# EAGLE schematic ranback_all (EAGLE 9.6.2)
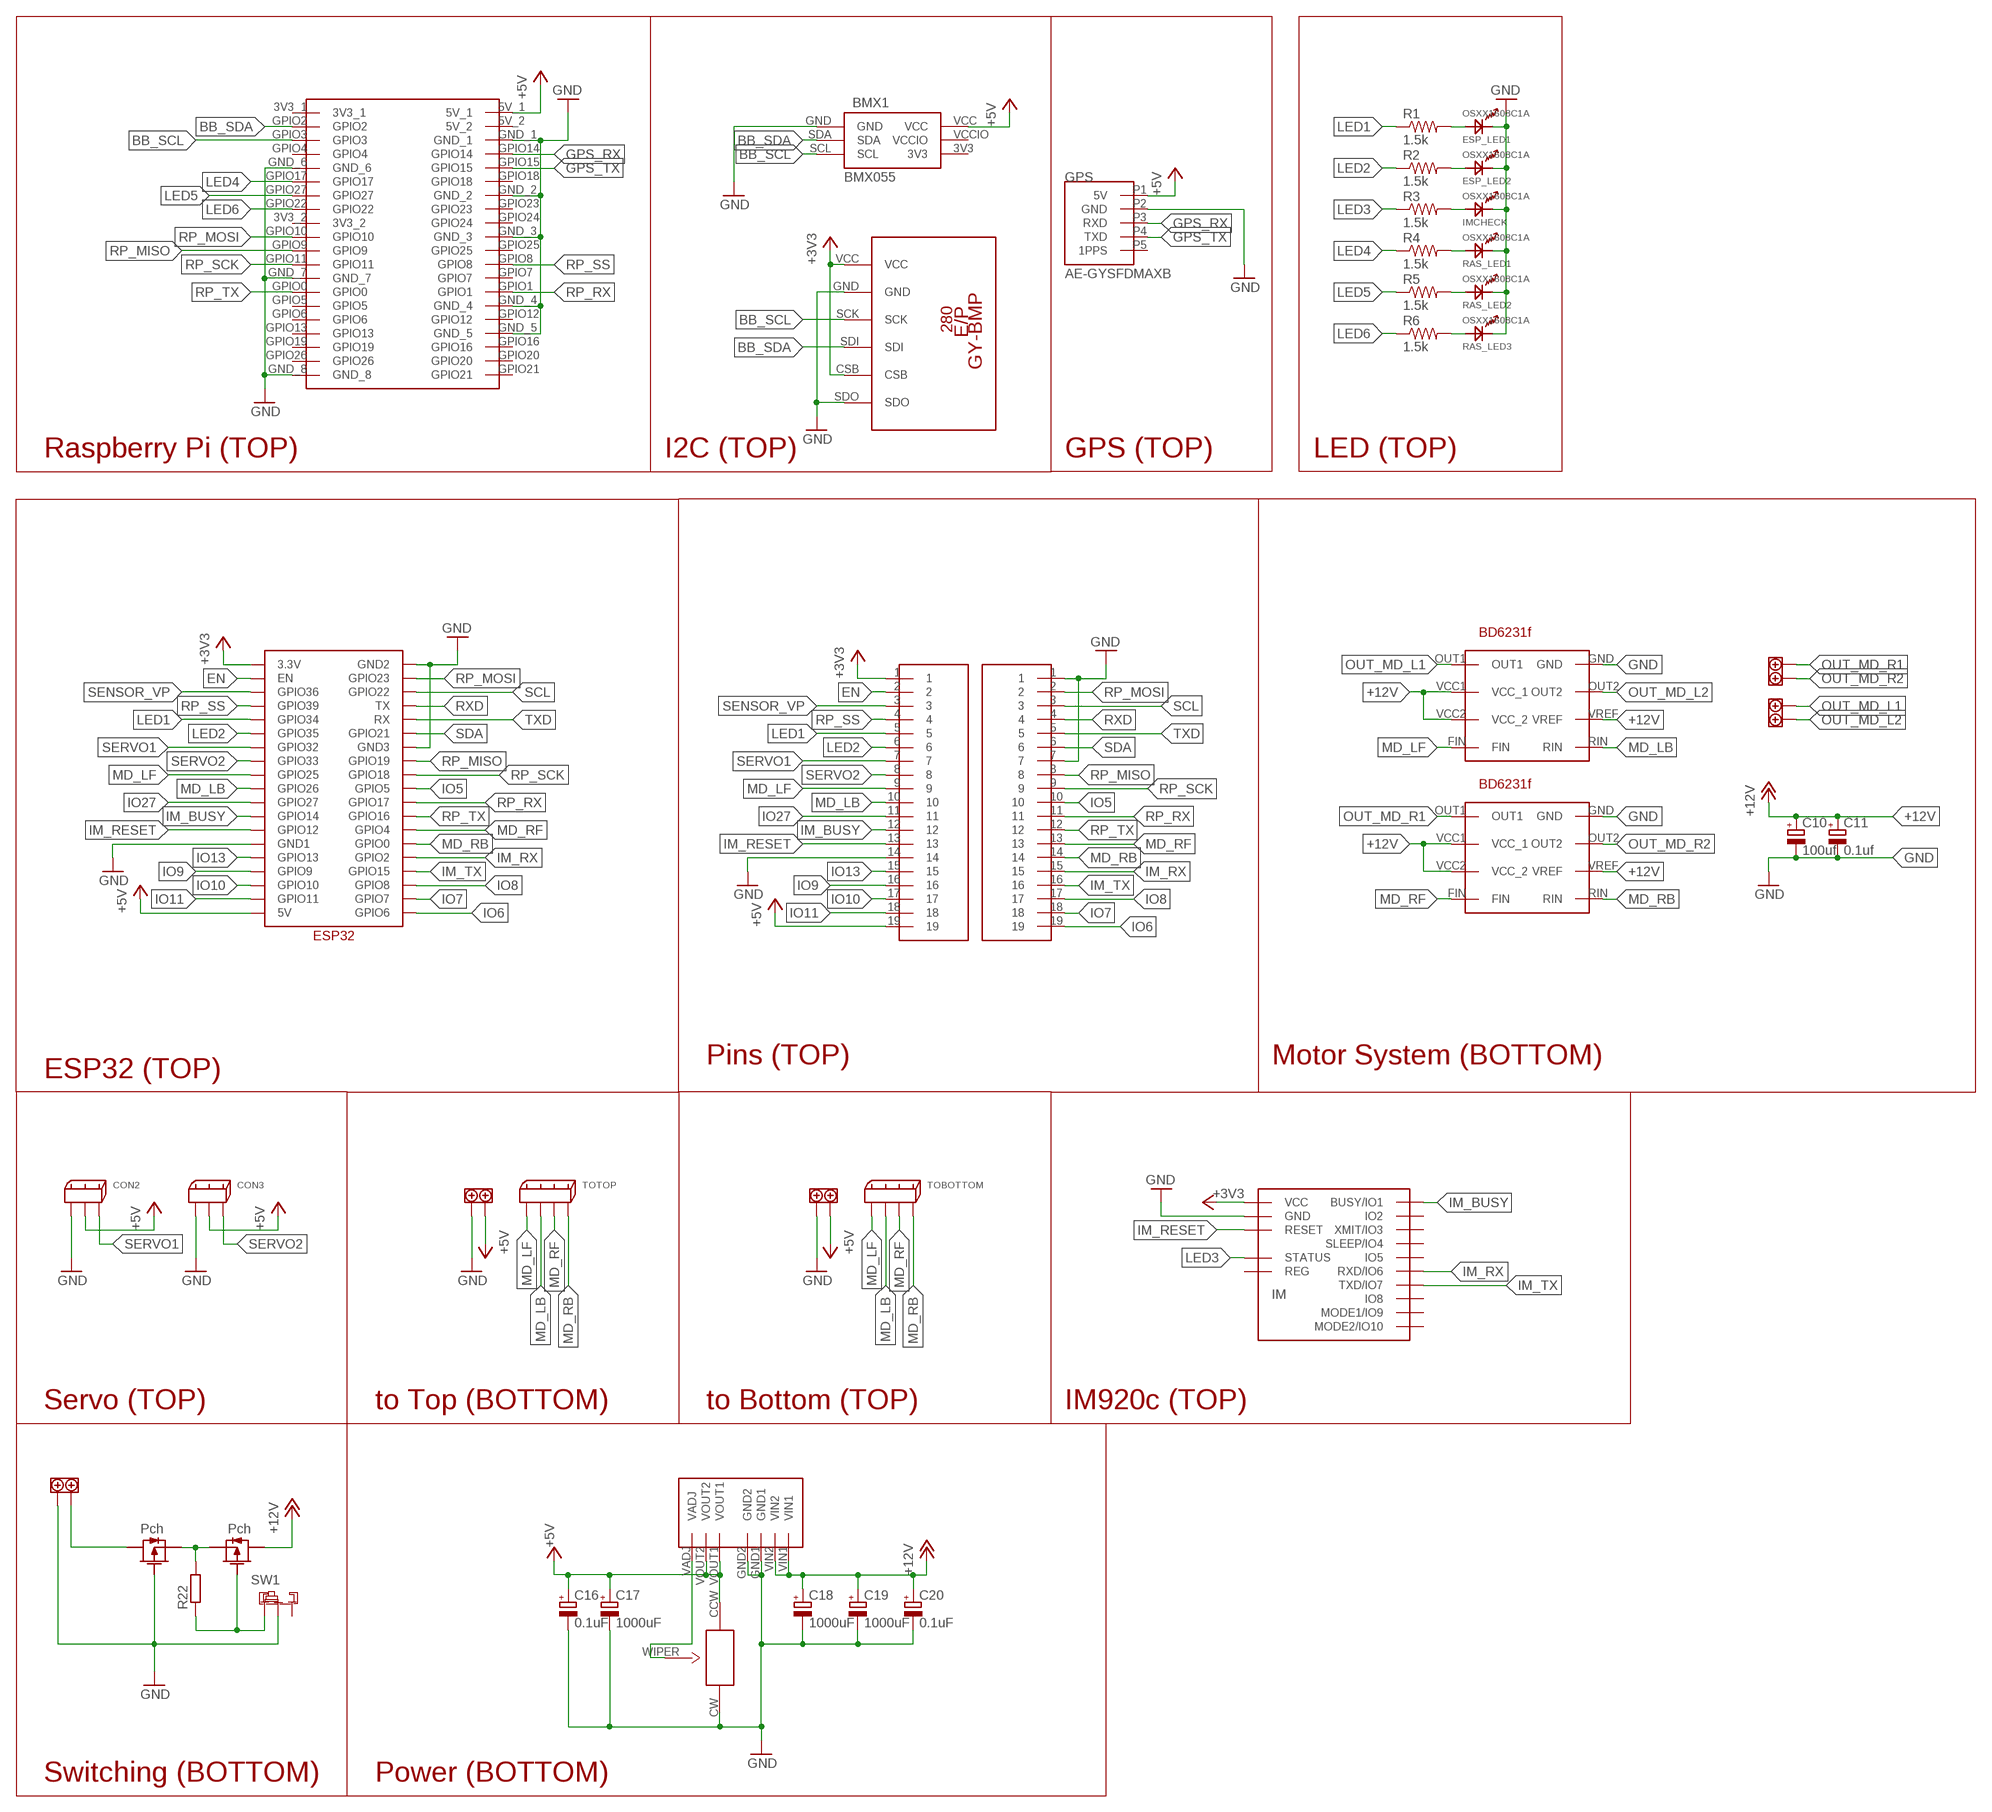
[diagram p0: schematic, sheet 1]

## Parts
100KR1  100kR  3362P  [3362P]
BMX1  BMX055  [BMX055]
C10  100uf  CPOL-EUE2.5-7  [E2,5-7]
C11  0.1uf  CPOL-EUE2.5-7  [E2,5-7]
C16  0.1uF  CPOL-EUE2.5-7  [E2,5-7]
C17  1000uF  CPOL-EUE5-10.5  [E5-10,5]
C18  1000uF  CPOL-EUE5-10.5  [E5-10,5]
C19  1000uF  CPOL-EUE5-10.5  [E5-10,5]
C20  0.1uF  CPOL-EUE2.5-7  [E2,5-7]
CON2  2.5_MINI-SPOX_3PIN  [2.5_MINI-SPOX_3PIN]
CON3  2.5_MINI-SPOX_3PIN  [2.5_MINI-SPOX_3PIN]
ESP_LED1  OSXX1608C1A  [OSXX1608C1A]
ESP_LED2  OSXX1608C1A  [OSXX1608C1A]
GPS  AE-GYSFDMAXB  [AE-GYSFDMAXB]
IM  IM920C  [IM920C]
IMCHECK  OSXX1608C1A  [OSXX1608C1A]
MD_L  BD6231F  [BD6231F]
MD_R  BD6231F  [BD6231F]
PIN_L  19_2.54  [19_2.54]
PIN_R  19_2.54  [19_2.54]
R1  1.5k  R-US_R0603  [R0603]
R2  1.5k  R-US_R0603  [R0603]
R3  1.5k  R-US_R0603  [R0603]
R4  1.5k  R-US_R0603  [R0603]
R5  1.5k  R-US_R0603  [R0603]
R6  1.5k  R-US_R0603  [R0603]
R22  R-EU_0207/10  [0207/10]
RAS_LED1  OSXX1608C1A  [OSXX1608C1A]
RAS_LED2  OSXX1608C1A  [OSXX1608C1A]
RAS_LED3  OSXX1608C1A  [OSXX1608C1A]
RASPBERRYPI_4B  RASPBERRYPI4B  [RASPBERRYPI4B]
SW1  SRIDE_SWITCH  [SRIDE_SWITCH]
TM1  TERMINAL_SLOPED_2PIN  [TERMINAL_SLOPED_2PIN]
TM2  TERMINAL_SLOPED_2PIN  [TERMINAL_SLOPED_2PIN]
TM3  TERMINAL_SLOPED_2PIN  [TERMINAL_SLOPED_2PIN]
TM4  TERMINAL_SLOPED_2PIN  [TERMINAL_SLOPED_2PIN]
TM5  TERMINAL_SLOPED_2PIN  [TERMINAL_SLOPED_2PIN]
TOBOTTOM  2.5_MINI-SPOX_4PIN  [2.5_MINI-SPOX_4PIN]
TOTOP  2.5_MINI-SPOX_4PIN  [2.5_MINI-SPOX_4PIN]
U$2  ESP32  [ESP32]
U$7  2SJ681-PCH  [2SJ681]
U$8  5V3A_KIC-053  [5V3A_KIC-053]
U$9  GY-BPM280  [GY-BMP280-FOOTPRINT]
U$10  2SJ681-PCH  [2SJ681]

## Nets
+3V3: IM.$P17(VCC) PIN_L.1 U$2.3.3V U$9.CSB U$9.VCC
+5V: 100KR1.CCW BMX1.VCC C16.+ C17.+ CON2.2 CON3.2 GPS.P1(5V) PIN_L.19 RASPBERRYPI_4B.5V_1 TM4.1 TM5.1 U$2.5V U$8.VOUT1 U$8.VOUT2
+12V: C10.+ C11.+ C18.+ C19.+ C20.+ MD_L.VCC1(VCC_1) MD_L.VCC2(VCC_2) MD_L.VREF MD_R.VCC1(VCC_1) MD_R.VCC2(VCC_2) MD_R.VREF U$8.VIN1 U$8.VIN2 U$10.DRAIN
A7_1: R22.2 U$7.SOURCE U$10.SOURCE
BB_SCL: BMX1.SCL RASPBERRYPI_4B.GPIO3 U$9.SCK
BB_SDA: BMX1.SDA RASPBERRYPI_4B.GPIO2 U$9.SDI
EN: PIN_L.2 U$2.EN
GND [GND_+12V]: 100KR1.CW BMX1.GND C10.- C11.- C16.- C17.- C18.- C19.- C20.- CON2.1 CON3.1 ESP_LED1.CT ESP_LED2.CT GPS.P2(GND) IM.$P18(GND) IMCHECK.CT MD_L.GND MD_R.GND PIN_L.14 PIN_R.1 PIN_R.7 RAS_LED1.CT RAS_LED2.CT RAS_LED3.CT RASPBERRYPI_4B.GND_1 RASPBERRYPI_4B.GND_2 RASPBERRYPI_4B.GND_3 RASPBERRYPI_4B.GND_4 RASPBERRYPI_4B.GND_5 RASPBERRYPI_4B.GND_6 RASPBERRYPI_4B.GND_7 RASPBERRYPI_4B.GND_8 SW1.LR TM3.2 TM4.2 TM5.2 U$2.GND1 U$2.GND2 U$2.GND3 U$7.GATE U$8.GND1 U$8.GND2 U$9.GND U$9.SDO
GPS_RX: GPS.P3(RXD) RASPBERRYPI_4B.GPIO14
GPS_TX: GPS.P4(TXD) RASPBERRYPI_4B.GPIO15
IM_BUSY: IM.$P1(BUSY/IO1) PIN_L.12 U$2.GPIO14
IM_RESET: IM.$P19(RESET) PIN_L.13 U$2.GPIO12
IM_RX: IM.$P6(RXD/IO6) PIN_R.15 U$2.GPIO2
IM_TX: IM.$P7(TXD/IO7) PIN_R.16 U$2.GPIO15
IO5: PIN_R.10 U$2.GPIO5
IO6: PIN_R.19 U$2.GPIO6
IO7: PIN_R.18 U$2.GPIO7
IO8: PIN_R.17 U$2.GPIO8
IO9: PIN_L.16 U$2.GPIO9
IO10: PIN_L.17 U$2.GPIO10
IO11: PIN_L.18 U$2.GPIO11
IO13: PIN_L.15 U$2.GPIO13
IO27: PIN_L.11 U$2.GPIO27
LED1: PIN_L.5 R1.1 U$2.GPIO34
LED2: PIN_L.6 R2.1 U$2.GPIO35
LED3: IM.$P15(STATUS) R3.1
LED4: R4.1 RASPBERRYPI_4B.GPIO17
LED5: R5.1 RASPBERRYPI_4B.GPIO27
LED6: R6.1 RASPBERRYPI_4B.GPIO22
MD_LB: MD_L.RIN PIN_L.10 TOBOTTOM.P$2 TOTOP.P$2 U$2.GPIO26
MD_LF: MD_L.FIN PIN_L.9 TOBOTTOM.P$1 TOTOP.P$1 U$2.GPIO25
MD_RB: MD_R.RIN PIN_R.14 TOBOTTOM.P$4 TOTOP.P$4 U$2.GPIO0
MD_RF: MD_R.FIN PIN_R.13 TOBOTTOM.P$3 TOTOP.P$3 U$2.GPIO4
N$1: ESP_LED1.AN R1.2
N$2: ESP_LED2.AN R2.2
N$3: IMCHECK.AN R3.2
N$4: R4.2 RAS_LED1.AN
N$5: R5.2 RAS_LED2.AN
N$6: R6.2 RAS_LED3.AN
N$9: TM3.1 U$7.DRAIN
N$18: 100KR1.WIPER U$8.VADJ
N$20: R22.1 SW1.L U$10.GATE
OUT_MD_L1 [GND_+12V]: MD_L.OUT1 TM2.1
OUT_MD_L2 [GND_+12V]: MD_L.OUT2 TM2.2
OUT_MD_R1 [GND_+12V]: MD_R.OUT1 TM1.1
OUT_MD_R2 [GND_+12V]: MD_R.OUT2 TM1.2
RP_MISO: PIN_R.8 RASPBERRYPI_4B.GPIO9 U$2.GPIO19
RP_MOSI: PIN_R.2 RASPBERRYPI_4B.GPIO10 U$2.GPIO23
RP_RX: PIN_R.11 RASPBERRYPI_4B.GPIO1 U$2.GPIO17
RP_SCK: PIN_R.9 RASPBERRYPI_4B.GPIO11 U$2.GPIO18
RP_SS: PIN_L.4 RASPBERRYPI_4B.GPIO8 U$2.GPIO39
RP_TX: PIN_R.12 RASPBERRYPI_4B.GPIO0 U$2.GPIO16
RXD [esp]: PIN_R.4 U$2.TX
SCL: PIN_R.3 U$2.GPIO22
SDA: PIN_R.6 U$2.GPIO21
SENSOR_VP: PIN_L.3 U$2.GPIO36
SERVO1: CON2.3 PIN_L.7 U$2.GPIO32
SERVO2: CON3.3 PIN_L.8 U$2.GPIO33
TXD [esp]: PIN_R.5 U$2.RX
Unconnected: GPS.P5(1PPS) IM.$P2(IO2) IM.$P3(XMIT/IO3) IM.$P4(SLEEP/IO4) IM.$P5(IO5) IM.$P8(IO8) IM.$P9(MODE1/IO9) IM.$P10(MODE2/IO10) IM.$P16(REG) RASPBERRYPI_4B.3V3_1 RASPBERRYPI_4B.3V3_2 RASPBERRYPI_4B.5V_2 RASPBERRYPI_4B.GPIO4 RASPBERRYPI_4B.GPIO5 RASPBERRYPI_4B.GPIO6 RASPBERRYPI_4B.GPIO7 RASPBERRYPI_4B.GPIO12 RASPBERRYPI_4B.GPIO13 RASPBERRYPI_4B.GPIO16 RASPBERRYPI_4B.GPIO18 RASPBERRYPI_4B.GPIO19 RASPBERRYPI_4B.GPIO20 RASPBERRYPI_4B.GPIO21 RASPBERRYPI_4B.GPIO23 RASPBERRYPI_4B.GPIO24 RASPBERRYPI_4B.GPIO25 RASPBERRYPI_4B.GPIO26 SW1.R

## Notes on the sheet
- Raspberry Pi (TOP) | I2C (TOP) | GPS (TOP) | LED (TOP)
- Pins (TOP) | Motor System (BOTTOM)
- ESP32 (TOP)
- Servo (TOP) | to Top (BOTTOM) | to Bottom (TOP) | IM920c (TOP)
- Switching (BOTTOM) | Power (BOTTOM)

## Power pins joined to a net without a drawn wire
3V3: BMX1.3V3
VCCIO: BMX1.VCCIO

## Library data of the parts
100KR1 = TRIM_register:3362P
BMX1 = BMX055:BMX055
C10 C11 C16-C20 = rcl:CPOL-EU: POLARIZED CAPACITOR, European symbol; SPICEPREFIX: C
CON2 CON3 = Connector:2.5_MINI-SPOX_3PIN
ESP_LED1 ESP_LED2 IMCHECK RAS_LED1-RAS_LED3 = ChipLED:OSXX1608C1A
GPS = AE-GYSFDMAXB:AE-GYSFDMAXB
IM = IM920:IM920C
MD_L MD_R = Motor Driver:BD6231F
PIN_L PIN_R = JumperPins:19_2.54
R1-R6 = rcl:R-US_: RESISTOR, American symbol; SPICEPREFIX: R
R22 = rcl:R-EU_: RESISTOR, European symbol; SPICEPREFIX: R
RASPBERRYPI_4B = RASPBERRYPI4B:RASPBERRYPI4B
SW1 = Switches:SRIDE_SWITCH
TM1-TM5 = TerminalBrock:TERMINAL_SLOPED_2PIN
TOBOTTOM TOTOP = Connector:2.5_MINI-SPOX_4PIN
U$2 = ESP32_dev:ESP32
U$7 U$10 = mosfet:2SJ681-PCH
U$8 = DC-DC:5V3A_KIC-053
U$9 = BMP280:GY-BPM280

## Net classes
1 esp: width 0.254 mm, drill 0.127 mm, clearance 0.025 mm
2 GND_+12V: width 0.305 mm